# Altium schematic sheet SMARC Pinout-2.SchDoc
size A4; SheetNumber: 4; SheetTotal: 11
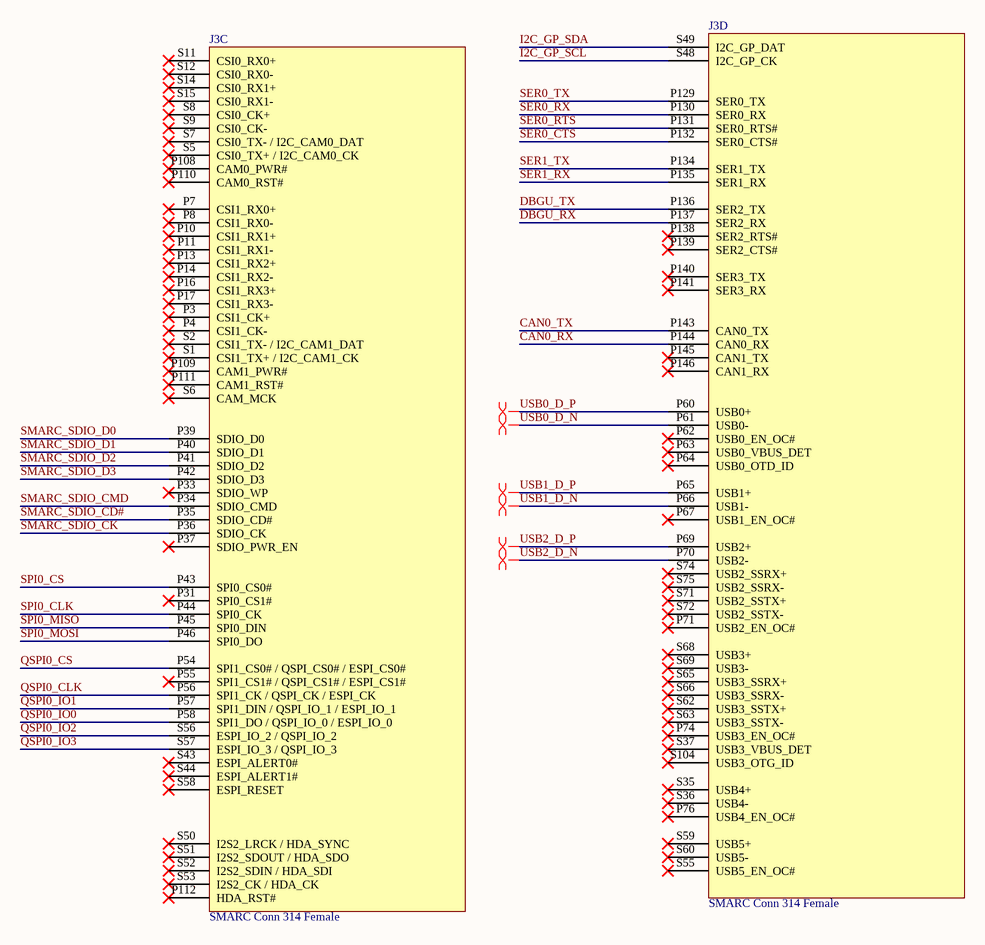
[diagram p0: SMARC Pinout-2.SchDoc]

## Parts
J3  SMARC Conn 314 Female  [SMARC 314 Female]  (parts C,D of 6)

## Nets
CAN0_RX: J3.P144(CAN0_RX)
CAN0_TX: J3.P143(CAN0_TX)
DBGU_RX: J3.P137(SER2_RX)
DBGU_TX: J3.P136(SER2_TX)
I2C_GP_SCL: J3.S48(I2C_GP_CK)
I2C_GP_SDA: J3.S49(I2C_GP_DAT)
QSPI0_CLK: J3.P56(SPI1_CK_/_QSPI_CK_/_ESPI_CK)
QSPI0_CS: J3.P54(SPI1_CS0#_/_QSPI_CS0#_/_ESPI_CS0#)
QSPI0_IO0: J3.P58(SPI1_DO_/_QSPI_IO_0_/_ESPI_IO_0)
QSPI0_IO1: J3.P57(SPI1_DIN_/_QSPI_IO_1_/_ESPI_IO_1)
QSPI0_IO2: J3.S56(ESPI_IO_2_/_QSPI_IO_2)
QSPI0_IO3: J3.S57(ESPI_IO_3_/_QSPI_IO_3)
SER0_CTS: J3.P132(SER0_CTS#)
SER0_RTS: J3.P131(SER0_RTS#)
SER0_RX: J3.P130(SER0_RX)
SER0_TX: J3.P129(SER0_TX)
SER1_RX: J3.P135(SER1_RX)
SER1_TX: J3.P134(SER1_TX)
SMARC_SDIO_CD#: J3.P35(SDIO_CD#)
SMARC_SDIO_CK: J3.P36(SDIO_CK)
SMARC_SDIO_CMD: J3.P34(SDIO_CMD)
SMARC_SDIO_D0: J3.P39(SDIO_D0)
SMARC_SDIO_D1: J3.P40(SDIO_D1)
SMARC_SDIO_D2: J3.P41(SDIO_D2)
SMARC_SDIO_D3: J3.P42(SDIO_D3)
SPI0_CLK: J3.P44(SPI0_CK)
SPI0_CS: J3.P43(SPI0_CS0#)
SPI0_MISO: J3.P45(SPI0_DIN)
SPI0_MOSI: J3.P46(SPI0_DO)
USB0_D_N: J3.P61(USB0-)
USB0_D_P: J3.P60(USB0+)
USB1_D_N: J3.P66(USB1-)
USB1_D_P: J3.P65(USB1+)
USB2_D_N: J3.P70(USB2-)
USB2_D_P: J3.P69(USB2+)

Not connected (* = marked no-connect by the designer): J3 P3(CSI1_CK+)* P4(CSI1_CK-)* P7(CSI1_RX0+)* P8(CSI1_RX0-)* P10(CSI1_RX1+)* P11(CSI1_RX1-)* P13(CSI1_RX2+)* P14(CSI1_RX2-)* P16(CSI1_RX3+)* P17(CSI1_RX3-)* P31(SPI0_CS1#)* P33(SDIO_WP)* P37(SDIO_PWR_EN)* P55(SPI1_CS1#_/_QSPI_CS1#_/_ESPI_CS1#)* P62(USB0_EN_OC#)* P63(USB0_VBUS_DET)* P64(USB0_OTD_ID)* P67(USB1_EN_OC#)* P71(USB2_EN_OC#)* P74(USB3_EN_OC#)* P76(USB4_EN_OC#)* P108(CAM0_PWR#)* P109(CAM1_PWR#)* P110(CAM0_RST#)* P111(CAM1_RST#)* P112(HDA_RST#)* P138(SER2_RTS#)* P139(SER2_CTS#)* P140(SER3_TX)* P141(SER3_RX)* P145(CAN1_TX)* P146(CAN1_RX)* S1(CSI1_TX+_/_I2C_CAM1_CK)* S2(CSI1_TX-_/_I2C_CAM1_DAT)* S5(CSI0_TX+_/_I2C_CAM0_CK)* S6(CAM_MCK)* S7(CSI0_TX-_/_I2C_CAM0_DAT)* S8(CSI0_CK+)* S9(CSI0_CK-)* S11(CSI0_RX0+)* S12(CSI0_RX0-)* S14(CSI0_RX1+)* S15(CSI0_RX1-)* S35(USB4+)* S36(USB4-)* S37(USB3_VBUS_DET)* S43(ESPI_ALERT0#)* S44(ESPI_ALERT1#)* S50(I2S2_LRCK_/_HDA_SYNC)* S51(I2S2_SDOUT_/_HDA_SDO)* S52(I2S2_SDIN_/_HDA_SDI)* S53(I2S2_CK_/_HDA_CK)* S55(USB5_EN_OC#)* S58(ESPI_RESET)* S59(USB5+)* S60(USB5-)* S62(USB3_SSTX+)* S63(USB3_SSTX-)* S65(USB3_SSRX+)* S66(USB3_SSRX-)* S68(USB3+)* S69(USB3-)* S71(USB2_SSTX+)* S72(USB2_SSTX-)* S74(USB2_SSRX+)* S75(USB2_SSRX-)* S104(USB3_OTG_ID)*

## Layout directives
differential pair: USB0_D_N, USB0_D_P, USB1_D_N, USB1_D_P, USB2_D_N, USB2_D_P